# EAGLE schematic RepRap Color Mixing companion module (EAGLE 9.0.0)
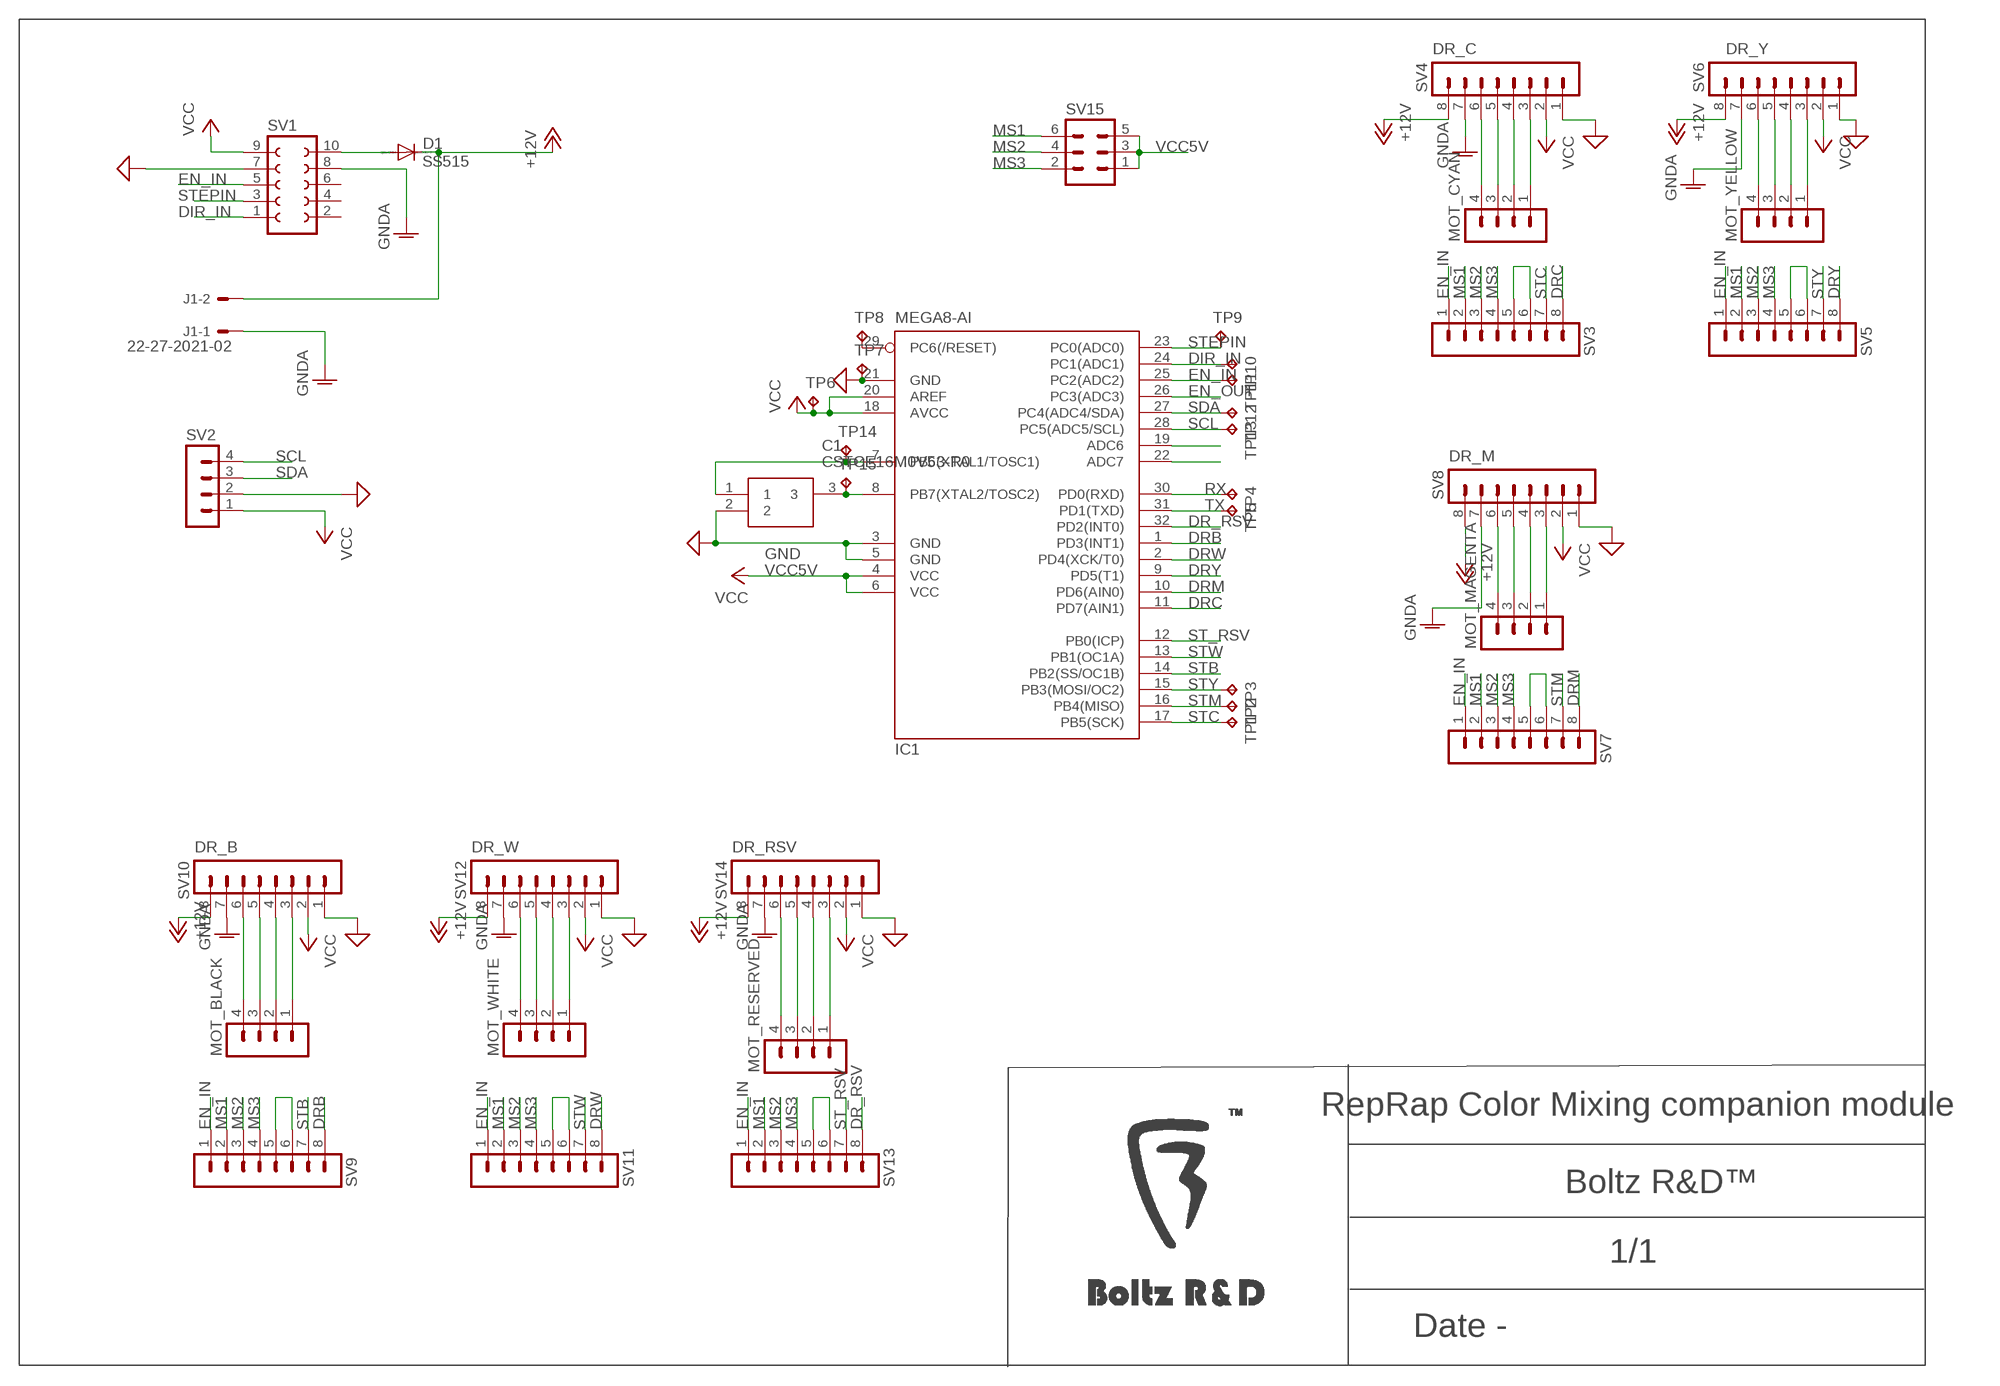
[diagram p0: schematic, sheet 1]

## Parts
C1  CSTCE16M0V53-R0  [CSTCE-V]
D1  SS515  DIODE-SMC  [SMC]
IC1  MEGA8-AI  [TQFP32-08]
J1  22-27-2021-02  [6410-02]
MOT_BLACK  MA04-1  [MA04-1]
MOT_CYAN  MA04-1  [MA04-1]
MOT_MAGENTA  MA04-1  [MA04-1]
MOT_RESERVED  MA04-1  [MA04-1]
MOT_WHITE  MA04-1  [MA04-1]
MOT_YELLOW  MA04-1  [MA04-1]
SV1  FE05-2  [FE05-2]
SV2  MA04-1  [MA04-1]
SV3  MA08-1  [MA08-1]
SV4  MA08-1  [MA08-1]
SV5  MA08-1  [MA08-1]
SV6  MA08-1  [MA08-1]
SV7  MA08-1  [MA08-1]
SV8  MA08-1  [MA08-1]
SV9  MA08-1  [MA08-1]
SV10  MA08-1  [MA08-1]
SV11  MA08-1  [MA08-1]
SV12  MA08-1  [MA08-1]
SV13  MA08-1  [MA08-1]
SV14  MA08-1  [MA08-1]
SV15  MA03-2  [MA03-2]
TP1  TPB1,27  [B1,27]
TP2  TPB1,27  [B1,27]
TP3  TPB1,27  [B1,27]
TP4  TPB1,27  [B1,27]
TP5  TPB1,27  [B1,27]
TP6  TPB1,27  [B1,27]
TP7  TPB1,27  [B1,27]
TP8  TPB1,27  [B1,27]
TP9  TPB1,27  [B1,27]
TP10  TPB1,27  [B1,27]
TP11  TPB1,27  [B1,27]
TP12  TPB1,27  [B1,27]
TP13  TPB1,27  [B1,27]
TP14  TPB1,27  [B1,27]
TP15  TPB1,27  [B1,27]

## Nets
+12V [PWR]: D1.C J1.2 SV4.8 SV6.8 SV8.8 SV10.8 SV12.8 SV14.8
DIR_IN: IC1.24(PC1(ADC1)) SV1.1 TP10.TP
DR_RSV: IC1.32(PD2(INT0)) SV13.8
DRB: IC1.1(PD3(INT1)) SV9.8
DRC: IC1.11(PD7(AIN1)) SV3.8
DRM: IC1.10(PD6(AIN0)) SV7.8
DRW: IC1.2(PD4(XCK/T0)) SV11.8
DRY: IC1.9(PD5(T1)) SV5.8
EN_IN: IC1.25(PC2(ADC2)) SV1.5 SV3.1 SV5.1 SV7.1 SV9.1 SV11.1 SV13.1 TP11.TP
EN_OUT: IC1.26(PC3(ADC3))
GND: C1.2 IC1.3(GND) IC1.5(GND) IC1.21(GND) SV1.7 SV2.2 SV4.1 SV6.1 SV8.1 SV10.1 SV12.1 SV14.1 TP7.TP ; supply symbol labelled SUP
GNDA [PWR]: J1.1 SV1.8 SV4.7 SV6.7 SV8.7 SV10.7 SV12.7 SV14.7
MS1: SV3.2 SV5.2 SV7.2 SV9.2 SV11.2 SV13.2 SV15.6
MS2: SV3.3 SV5.3 SV7.3 SV9.3 SV11.3 SV13.3 SV15.4
MS3: SV3.4 SV5.4 SV7.4 SV9.4 SV11.4 SV13.4 SV15.2
N$1: C1.3 IC1.8(PB7(XTAL2/TOSC2)) TP15.TP
N$2: C1.1 IC1.7(PB6(XTAL1/TOSC1)) TP14.TP
N$3: IC1.29(PC6(/RESET)) TP8.TP
N$4: D1.A SV1.10
N$5: SV3.5 SV3.6
N$11: MOT_CYAN.1 SV4.3
N$12: MOT_CYAN.2 SV4.4
N$13: MOT_CYAN.3 SV4.5
N$14: MOT_CYAN.4 SV4.6
N$21: SV5.5 SV5.6
N$27: MOT_YELLOW.1 SV6.3
N$28: MOT_YELLOW.2 SV6.4
N$29: MOT_YELLOW.3 SV6.5
N$30: MOT_YELLOW.4 SV6.6
N$37: SV7.5 SV7.6
N$38: IC1.22(ADC7)
N$43: MOT_MAGENTA.1 SV8.3
N$44: MOT_MAGENTA.2 SV8.4
N$45: MOT_MAGENTA.3 SV8.5
N$46: MOT_MAGENTA.4 SV8.6
N$49: IC1.19(ADC6)
N$53: SV9.5 SV9.6
N$59: MOT_BLACK.1 SV10.3
N$60: MOT_BLACK.2 SV10.4
N$61: MOT_BLACK.3 SV10.5
N$62: MOT_BLACK.4 SV10.6
N$69: SV11.5 SV11.6
N$75: MOT_WHITE.1 SV12.3
N$76: MOT_WHITE.2 SV12.4
N$77: MOT_WHITE.3 SV12.5
N$78: MOT_WHITE.4 SV12.6
N$85: SV13.5 SV13.6
N$91: MOT_RESERVED.1 SV14.3
N$92: MOT_RESERVED.2 SV14.4
N$93: MOT_RESERVED.3 SV14.5
N$94: MOT_RESERVED.4 SV14.6
RX: IC1.30(PD0(RXD)) TP4.TP
SCL: IC1.28(PC5(ADC5/SCL)) SV2.4 TP13.TP
SDA: IC1.27(PC4(ADC4/SDA)) SV2.3 TP12.TP
ST_RSV: IC1.12(PB0(ICP)) SV13.7
STB: IC1.14(PB2(SS/OC1B)) SV9.7
STC: IC1.17(PB5(SCK)) SV3.7 TP1.TP
STEPIN: IC1.23(PC0(ADC0)) SV1.3 TP9.TP
STM: IC1.16(PB4(MISO)) SV7.7 TP2.TP
STW: IC1.13(PB1(OC1A)) SV11.7
STY: IC1.15(PB3(MOSI/OC2)) SV5.7 TP3.TP
TX: IC1.31(PD1(TXD)) TP5.TP
VCC: IC1.18(AVCC) IC1.20(AREF) SV1.9 SV2.1 SV4.2 SV6.2 SV8.2 SV10.2 SV12.2 SV14.2 TP6.TP
VCC5V: IC1.4(VCC) IC1.6(VCC) SV15.1 SV15.3 SV15.5 ; supply symbol labelled VCC
Unconnected: SV1.2 SV1.4 SV1.6

## Notes on the sheet
- DR_C | DR_Y
- DR_M
- DR_B | DR_W | DR_RSV

## Library data of the parts
C1 = SamacSys_Parts:CSTCE16M0V53-R0: Ceramic resonator SMT CSTCE 16.00MHz CSTCE16M0V53-R0, Ceramic Resonator, 16MHz Expander 15pF, 3-Pin Cap Chip, 3.2 x 1.3 x 0.9mm Source: Datasheet <http://uk.rs-online.com/web/p/products/6241077>; ARROW_PART_NUMBER: CSTCE16M0V53-R0; ARROW_PRICE/STOCK: https://www.arrow.com/en/products/cstce16m0v53-r0/murata-manufacturing; DESCRIPTION: Ceramic resonator SMT CSTCE 16.00MHz CSTCE16M0V53-R0, Ceramic Resonator, 16MHz Expander 15pF, 3-Pin Cap Chip, 3.2 x 1.3 x 0.9mm; HEIGHT: mm; MANUFACTURER_NAME: Murata Electronics; MANUFACTURER_PART_NUMBER: CSTCE16M0V53-R0; RS_PART_NUMBER: 7926524P; RS_PRICE/STOCK: http://uk.rs-online.com/web/p/products/7926524P
D1 = diode:DIODE-: DIODE
IC1 = atmel:MEGA8: MICROCONTROLLER 8 Kbytes FLASH, 1 kbytes SRAM, 512 bytes EEPROM, USART, 6-channel 10 bit ADC, 2-channel 8 bit ADC Pin compatible with Atmega48, ATMega88, ATMega168 Source: avr.lbr; MPN: ATMEGA8-16AU; OC_FARNELL: 9171371; OC_NEWARK: 73M8863
J1 = con-molex:22-?-02: CONNECTOR wire to board 2.54 mm (.1 inch) pitch header; MF: MOLEX; OC_FARNELL: unknown; OC_NEWARK: unknown
MOT_BLACK MOT_CYAN MOT_MAGENTA MOT_RESERVED MOT_WHITE MOT_YELLOW SV2 = con-lstb:MA04-1: PIN HEADER; OC_FARNELL: unknown; OC_NEWARK: unknown
SV1 = con-lsta:FE05-2: FEMALE HEADER; OC_FARNELL: unknown; OC_NEWARK: unknown
SV3-SV14 = con-lstb:MA08-1: PIN HEADER; OC_FARNELL: unknown; OC_NEWARK: unknown
SV15 = con-lstb:MA03-2: PIN HEADER; OC_FARNELL: unknown; OC_NEWARK: unknown
TP1-TP15 = testpad:TP: Test pad

## Net classes
0 default: width 0.356 mm, clearance 0.254 mm
1 PWR: width 0.864 mm, drill 0.1 mm, clearance 0.305 mm